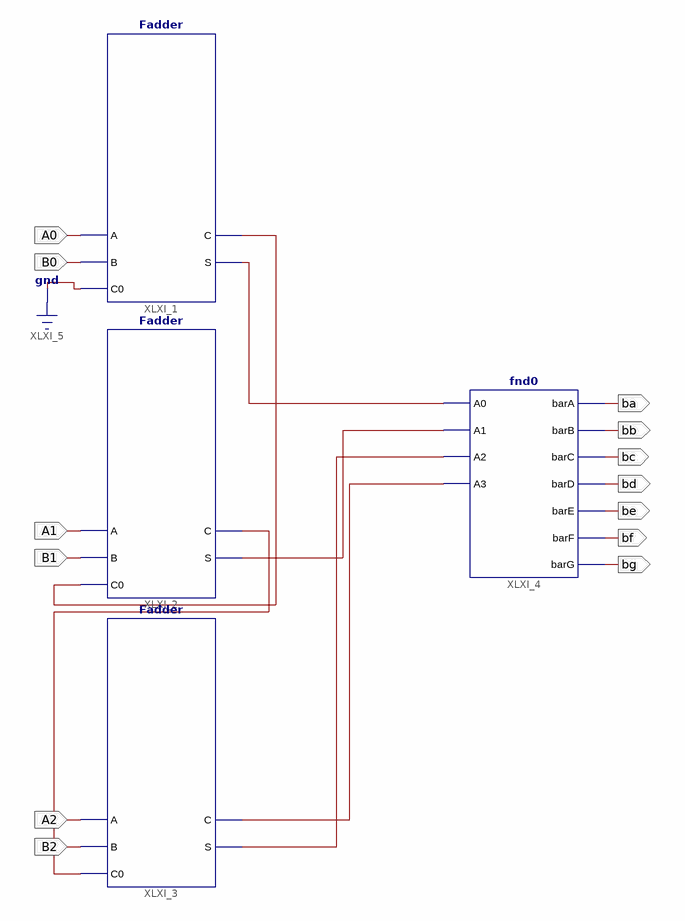
[diagram p0: schematic sheet 1]
// Xilinx ISE schematic fadder3_1.sch (virtex4) as structural Verilog: 4 symbols, 13 ports
module fadder3_1 (
  input  A0,
  input  B0,
  input  A1,
  input  B1,
  input  A2,
  input  B2,
  output ba,
  output bb,
  output bc,
  output bd,
  output be,
  output bf,
  output bg
);

  wire XLXN_1, XLXN_2, XLXN_4, XLXN_5, XLXN_6, XLXN_7;

  Fadder XLXI_1 (.A(A0), .B(B0), .C0(1'b0), .C(XLXN_1), .S(XLXN_4));
  Fadder XLXI_2 (.A(A1), .B(B1), .C0(XLXN_1), .C(XLXN_2), .S(XLXN_5));
  Fadder XLXI_3 (.A(A2), .B(B2), .C0(XLXN_2), .C(XLXN_6), .S(XLXN_7));
  fnd0 XLXI_4 (
    .A0(XLXN_4), .A1(XLXN_5), .A2(XLXN_7), .A3(XLXN_6), .barA(ba), .barB(bb), .barC(bc), .barD(bd),
    .barE(be), .barF(bf), .barG(bg));
endmodule
